# Altium schematic sheet MLX75305_EvalBoard.SchDoc
size A4; ApprovedBy: Stanislav Vodolagin; Author: Stanislav Vodolagin; CompanyName: Stason Corp; Organization: Stason Corp; Address1: Riga; Address2: Latvia; SheetNumber: 1; SheetTotal: 1
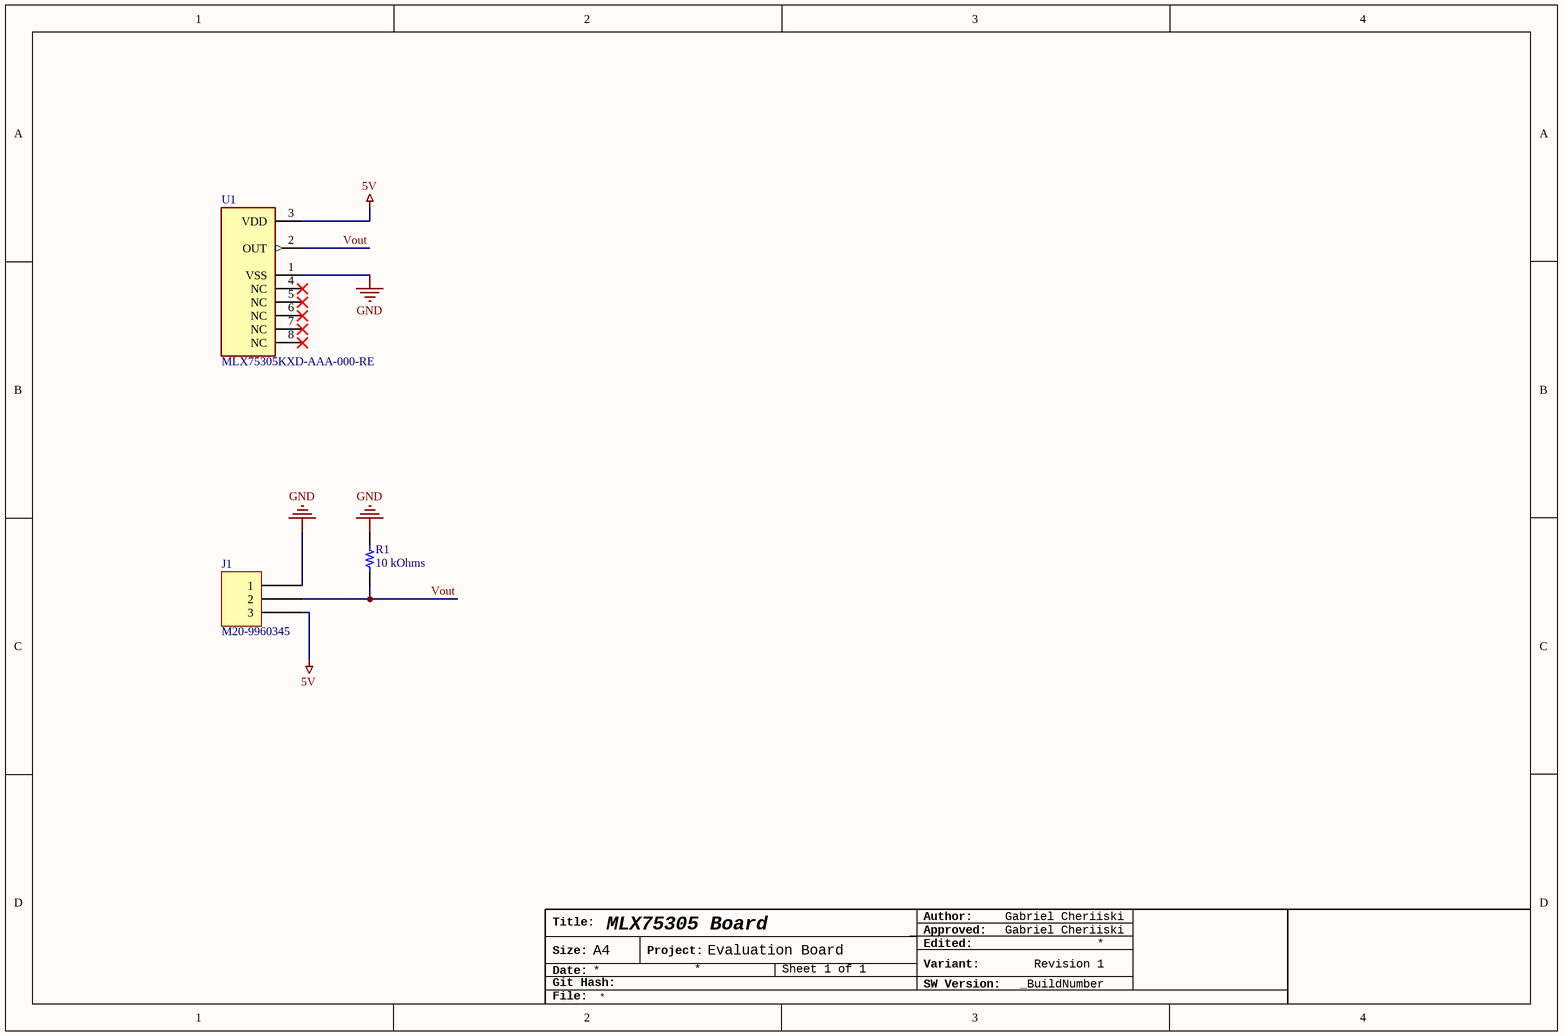
[diagram p0: MLX75305_EvalBoard.SchDoc]

## Parts
J1  M20-9960345  [HARWIN M20-9960345]
R1  10 kOhms  [RES 0805_2012]
U1  MLX75305KXD-AAA-000-RE  [SOIC127P599X175-8N]

## Nets
5V: J1.3 U1.3(VDD)
GND: J1.1 R1.2 U1.1(VSS)
Vout: J1.2 R1.1 U1.2(OUT)

Not connected (* = marked no-connect by the designer): U1 4(NC)* 5(NC)* 6(NC)* 7(NC)* 8(NC)*

## Notes on the sheet
- Title:
- MLX75305 Board
- Author:
- Approved:
- Gabriel Cheriiski
- Size:
- Date:
- Git Hash:
- A4
- Project:
- Evaluation Board
- SW Version:
- Variant:
- Edited:
- _BuildNumber
- Revision 1
- File:

## Library data of the parts
J1 = M20-9960345: CONN HEADER R/A 3POS 2.54MM; Manufacturer: Harwin Inc.; Connector Type: Header, Cuttable; Contact Length - Mating: 0.240" (6.10mm); Contact Length - Post: 0.118" (3.00mm); Current Rating (Amps): 3A per Contact; Material Flammability Rating: UL94 V-0; Number of Positions: 3; Number of Positions Loaded: All; Pitch - Mating: 0.100" (2.54mm); Row Spacing - Mating: -40°C ~ 105°C; Shrouding: Unshrouded; Style: Board to Board or Cable; Part Number: M20-9960345; ComponentLink1Description: Datasheet; ComponentLink1URL: https://cdn.harwin.com/pdfs/Harwin_PC_Connectors_M20.pdf; ComponentLink2Description: DigiKey Link; ComponentLink2URL: https://www.digikey.com/en/products/detail/harwin-inc/M20-9960345/3728209; Contact Finish - Mating: Gold; Contact Material: Brass; Contact Shape: Square; Contact Type: Male Pin; Fastening Type: Push-Pull; Insulation Color: Black; Insulation Height: 0.100" (2.54mm); Insulation Material: Polyamide (PA6T), Nylon 6T; LastUpdated: 21.9.2022 г. 19:23:07; Lifecycle Status: Active; Minimum Order: 1; Mounting Type: Through Hole, Right Angle; Number of Rows: 1; Operating Temperature: -40°C ~ 105°C; Packaging: Bulk; PartId: 166; Part Status: Active; Price: 0.09; Series: M20; Supplier 1: DigiKey; Supplier Part Number 1: 952-2245-ND; Termination: Solder
R1 = AC0805JR-0710KL: RES SMD 10K OHM 5% 1/8W 0805; Manufacturer: Yageo; Power (Watts): 0.125W, 1/8W; Temperature Coefficient: ±100ppm/°C; Part Number: AC0805JR-0710KL; Value: 10 kOhms; ComponentLink1Description: Datasheet; ComponentLink1URL: https://www.yageo.com/upload/media/product/productsearch/datasheet/rchip/PYu-AC_51_RoHS_L_7.pdf; ComponentLink2Description: DigiKey Link; ComponentLink2URL: https://www.digikey.com/en/products/detail/yageo/AC0805JR-0710KL/5897043; Composition: Thick Film; Device Package: 0805 (2012 Metric); Features: Automotive AEC-Q200, Moisture Resistant; Height - Seated (Max): 0.024" (0.60mm); LastUpdated: 24.11.2023 г. 21:00:57; Lifecycle Status: Active; Minimum Order: 1; Number of Terminations: 2; Operating Temperature: -55°C ~ 155°C; Package / Case: 0805 (2012 Metric); Packaging: TapeAndReel; PartId: 47032; Part Status: Active; Price: 0.01; Ratings: AEC-Q200; Resistance: 10 kOhms; Series: AC; Size / Dimension: 0.079" L x 0.049" W (2.00mm x 1.25mm); Supplier 1: DigiKey; Supplier Part Number 1: YAG3758CT-ND; Supplier Device Package: 0805; Tolerance: ±5%
U1 = MLX75305KXD-AAA-000-RE: Optical Sensor Ambient 850nm Voltage 8-SOIC (0.154, 3.90mm Width); MF: Melexis Technologies NV; Package: SOIC-8 Melexis; Purchase-URL: https://pricing.snapeda.com/search/part/MLX75305KXD-AAA-000-RE/?ref=eda; MP: MLX75305KXD-AAA-000-RE; Value: *; Availability: In Stock; SnapEDA_Link: https://www.snapeda.com/parts/MLX75305KXD-AAA-000-RE/Melexis+Technologies+NV/view-part/?ref=snap; Price: None; Check_prices: https://www.snapeda.com/parts/MLX75305KXD-AAA-000-RE/Melexis+Technologies+NV/view-part/?ref=eda